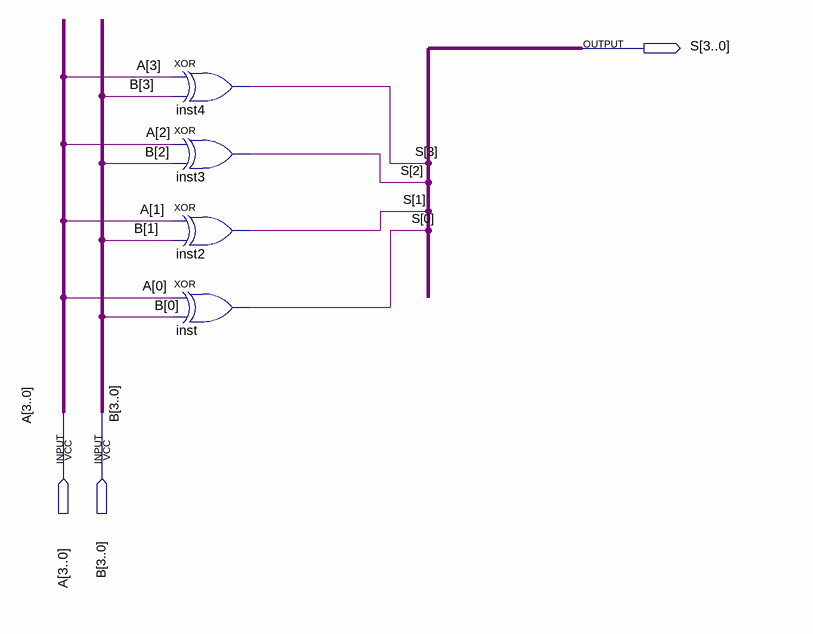
[diagram p0: schematic sheet]
// Quartus schematic AxorB - Copy.bdf as structural Verilog: 4 symbols, 3 pins
module \AxorB_-_Copy  (
  input  [3:0] A,
  input  [3:0] B,
  output [3:0] S
);

  xor inst4 (S[3], A[3], B[3]);
  xor inst3 (S[2], A[2], B[2]);
  xor inst2 (S[1], A[1], B[1]);
  xor inst (S[0], A[0], B[0]);
endmodule
